# EAGLE design ir-board (EAGLE 6.6.0)
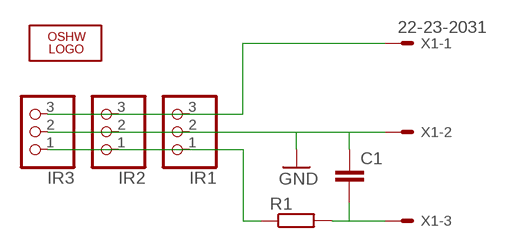
[diagram p0: schematic, sheet 1]

## Parts
C1  C-EUC1206  [C1206]
IR1  PINHD-1X3  [1X03]
IR2  PINHD-1X3  [1X03]
IR3  PINHD-1X3  [1X03]
LOGO1  OSHW_LOGO_6MILX0200-NT  [OSHW_6X200_NOTEXT]
R1  R-EU_R1206  [R1206]
X1  22-23-2031  [22-23-2031]

## Nets
GND: C1.1 IR1.2 IR2.2 IR3.2 X1.2
N$1: C1.2 R1.2 X1.3
OUT: IR1.3 IR2.3 IR3.3 X1.1
VS: IR1.1 IR2.1 IR3.1 R1.1

## Library data of the parts
C1 = rcl:C-EU: CAPACITOR, European symbol
IR1-IR3 = pinhead:PINHD-1X3: PIN HEADER
LOGO1 = ohw-logo:OSHW_LOGO_6MIL
R1 = rcl:R-EU_: RESISTOR, European symbol
X1 = con-molex:22-23-2031: .100" (2.54mm) Center Header - 3 Pin; MF: MOLEX; MPN: 22-23-2031; OC_FARNELL: 1462950; OC_NEWARK: 30C0862

## Board
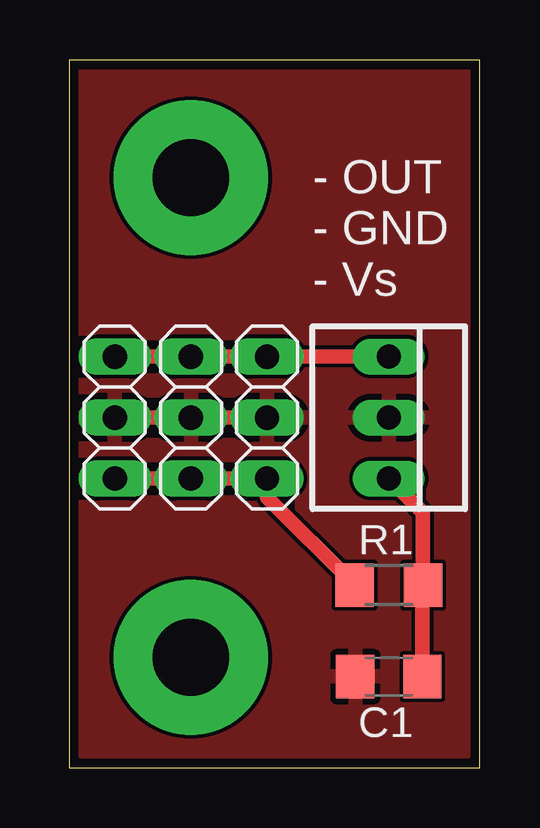
[diagram p1: board, top side]
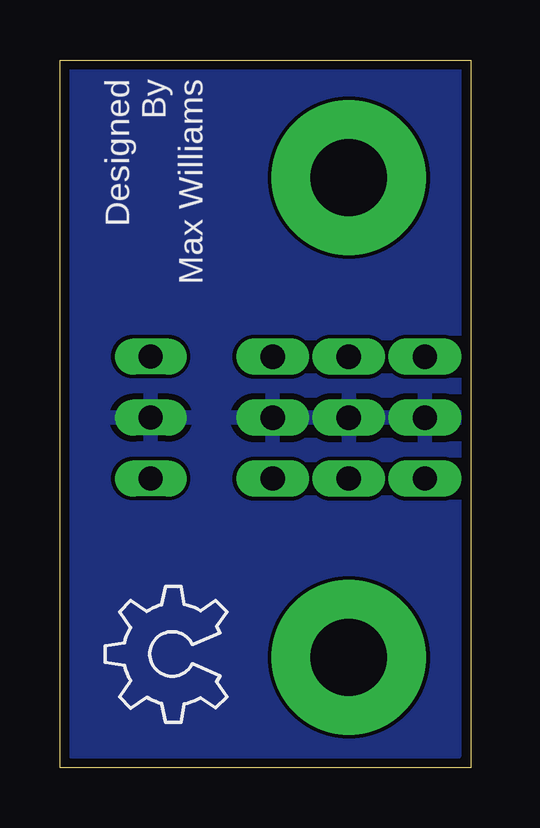
[diagram p2: board, bottom side, seen from below]

Size 17.12 x 29.52 mm. Coordinates in mm from the lower left corner, seen from the top.
Outline: 0,0 17.12,0 17.12,29.52 0,29.52 0,0
Copper layers (1*16): Top 0.0356mm / dielectric 1.5011mm / Bottom 0.0356mm
Design rules "LaenPCBOrder": minimum track width 6mil, minimum drill 13mil, track to track 6mil, track to pad 6mil, pad to pad 6mil, via to via 6mil, smd to smd 6mil, copper to edge 15mil, drill to drill 6mil, minimum pad ring 7mil, minimum via ring 7mil, stop-mask expansion 3mil, vias tented up to drill 0mil, thermal gap 10mil

### Footprints (pad centres in the part's own frame; a part is rotated, then mirrored left to right if it is on the bottom)
C1206 = smd 1.6 x 1.8: 1 -1.4,0; 2 1.4,0
1X03 = drill 1.016 long: 1 -2.54,0; 2 0,0; 3 2.54,0
R1206 = smd 1.6 x 1.803: 1 -1.422,0; 2 1.422,0
22-23-2031 = drill 1 long: 1 -2.54,0; 2 0,0; 3 2.54,0

### Placement (x,y rotation side)
C1  13.34,3.81 0 top
IR1  1.91,14.61 90 top
IR2  5.08,14.61 90 top
IR3  8.26,14.61 90 top
LOGO1  10.16,1.91 90 bottom
R1  13.34,7.62 0 top
X1  13.34,14.61 270 top

### Tracks (layer width: path | path; a pad name or v marks a point on that pad's centre or on a via)
GND
  Top 0.61: IR1.2 IR2.2 IR3.2
  pour Bottom: 0.64,29.21 16.51,29.21 16.51,0.64 0.64,0.64
  pour Top: 0.64,29.21 16.51,29.21 16.51,0.64 0.64,0.64
N$1
  Top 0.61: X1.3 14.76,10.64 R1.2 14.73,7.6 C1.2
N$2  (via drill 3.2 pad 6.45)
  other vias: 5.08,4.6
N$3  (via drill 3.2 pad 6.45)
  other vias: 5.08,24.61
OUT
  Top 0.61: IR1.3 IR2.3 IR3.3 X1.1
VS
  Top 0.61: IR1.1 IR2.1 IR3.1 8.26,11.28 R1.1

### Text on the board
tNames: - OUT / - GND / - Vs
bNames: Designed / By / Max Williams